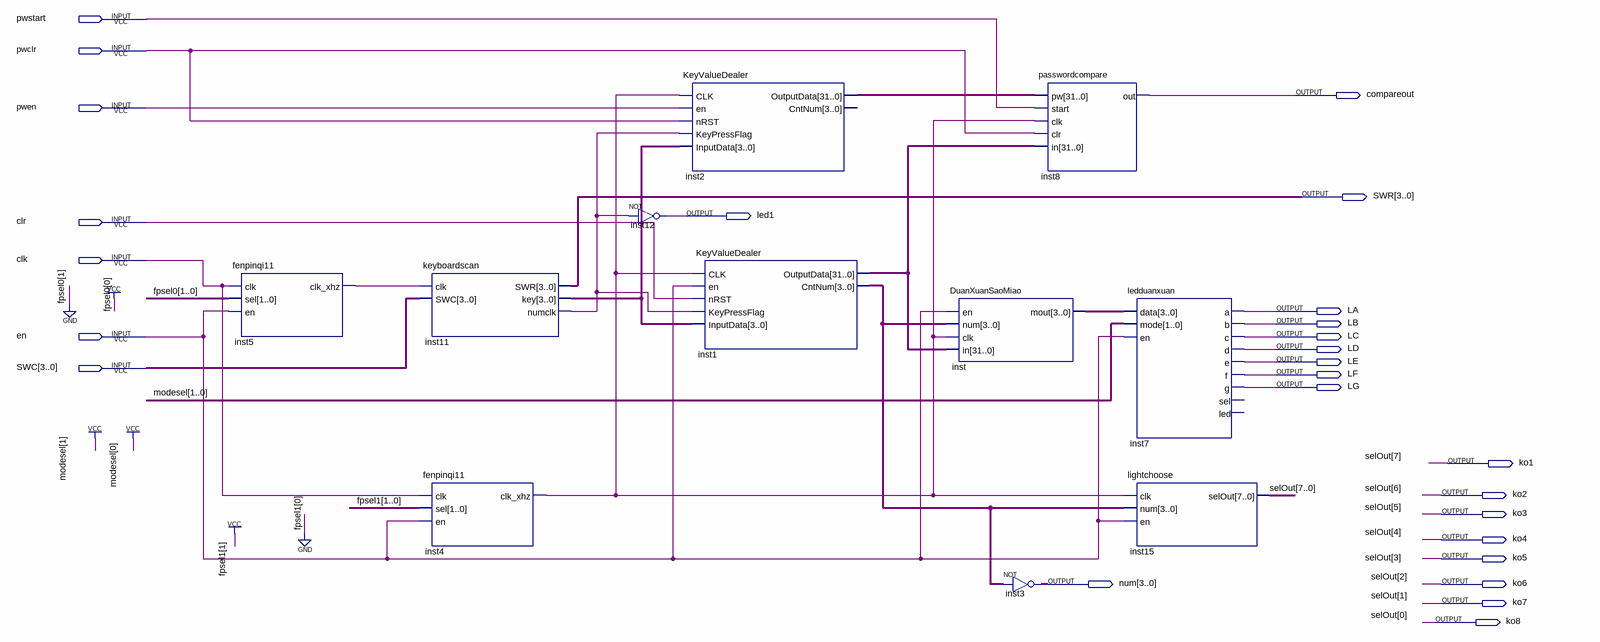
[diagram p0: schematic sheet]
// Quartus schematic g04_190711_11.bdf as structural Verilog: 11 symbols, 26 pins
module g04_190711_11 (
  input  pwstart,
  input  pwclr,
  input  pwen,
  input  clr,
  input  clk,
  input  en,
  input  [3:0] SWC,
  output compareout,
  output [3:0] SWR,
  output led1,
  output LA,
  output LB,
  output LC,
  output LD,
  output LE,
  output LF,
  output LG,
  output ko1,
  output ko2,
  output ko3,
  output ko4,
  output ko5,
  output [3:0] num,
  output ko6,
  output ko7,
  output ko8
);

  wire inst4_clk_xhz, inst5_clk_xhz, inst11_numclk;
  wire [3:0] inst1_cntnum, inst11_key, inst_mout;
  wire [31:0] inst1_outputdata, inst2_outputdata;

  fenpinqi11 inst5 (.clk(clk), .sel(2'b01), .en(en), .clk_xhz(inst5_clk_xhz));
  keyboardscan inst11 (.clk(inst5_clk_xhz), .SWC(SWC), .SWR(SWR), .key(inst11_key), .numclk(inst11_numclk));
  fenpinqi11 inst4 (.clk(clk), .sel(2'b10), .en(en), .clk_xhz(inst4_clk_xhz));
  not inst12 (led1, inst11_numclk);
  KeyValueDealer inst2 (
    .CLK(inst4_clk_xhz), .en(pwen), .nRST(pwclr), .KeyPressFlag(inst11_numclk), .InputData(inst11_key),
    .OutputData(inst2_outputdata));  // open: CntNum
  KeyValueDealer inst1 (
    .CLK(inst4_clk_xhz), .en(en), .nRST(clr), .KeyPressFlag(inst11_numclk), .InputData(inst11_key),
    .OutputData(inst1_outputdata), .CntNum(inst1_cntnum));
  DuanXuanSaoMiao inst (.en(en), .num(inst1_cntnum), .clk(inst4_clk_xhz), .in(inst1_outputdata), .mout(inst_mout));
  assign num = ~inst1_cntnum;  // NOT inst3, 4 bits wide
  passwordcompare inst8 (
    .pw(inst2_outputdata), .start(pwstart), .clk(inst4_clk_xhz), .clr(pwclr), .in(inst1_outputdata),
    .out(compareout));
  ledduanxuan inst7 (
    .data(inst_mout), .mode(2'b11), .en(en), .a(LA), .b(LB), .c(LC), .d(LD), .e(LE), .f(LF), .g(LG));  // open: sel, led
  lightchoose inst15 (
    .clk(inst4_clk_xhz), .num(inst1_cntnum), .en(en), .selOut({ko1, ko2, ko3, ko4, ko5, ko6, ko7, ko8}));

  // Other names for the same wires on the sheet: selOut[7:0] = {ko1, ko2, ko3, ko4, ko5, ko6, ko7, ko8}
endmodule
